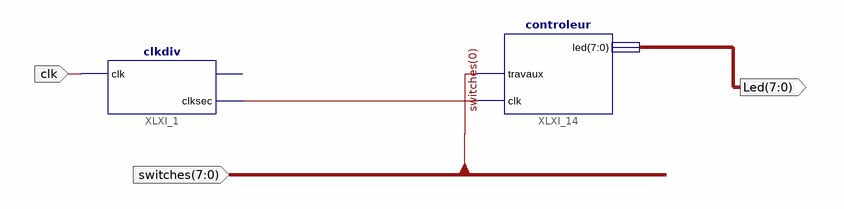
[diagram p0: schematic sheet 1]
// Xilinx ISE schematic toplevel.sch (spartan6) as structural Verilog: 2 symbols, 3 ports
module toplevel (
  input  clk,
  input  [7:0] switches,
  output [7:0] Led
);

  wire XLXN_8;

  clkdiv XLXI_1 (.clk(clk), .clksec(XLXN_8));  // open: clk190
  controleur XLXI_14 (.travaux(switches[0]), .clk(XLXN_8), .led(Led));
endmodule
